# EAGLE design PCB-TLY-JACK-LEDPHOENIX (EAGLE 6.4)
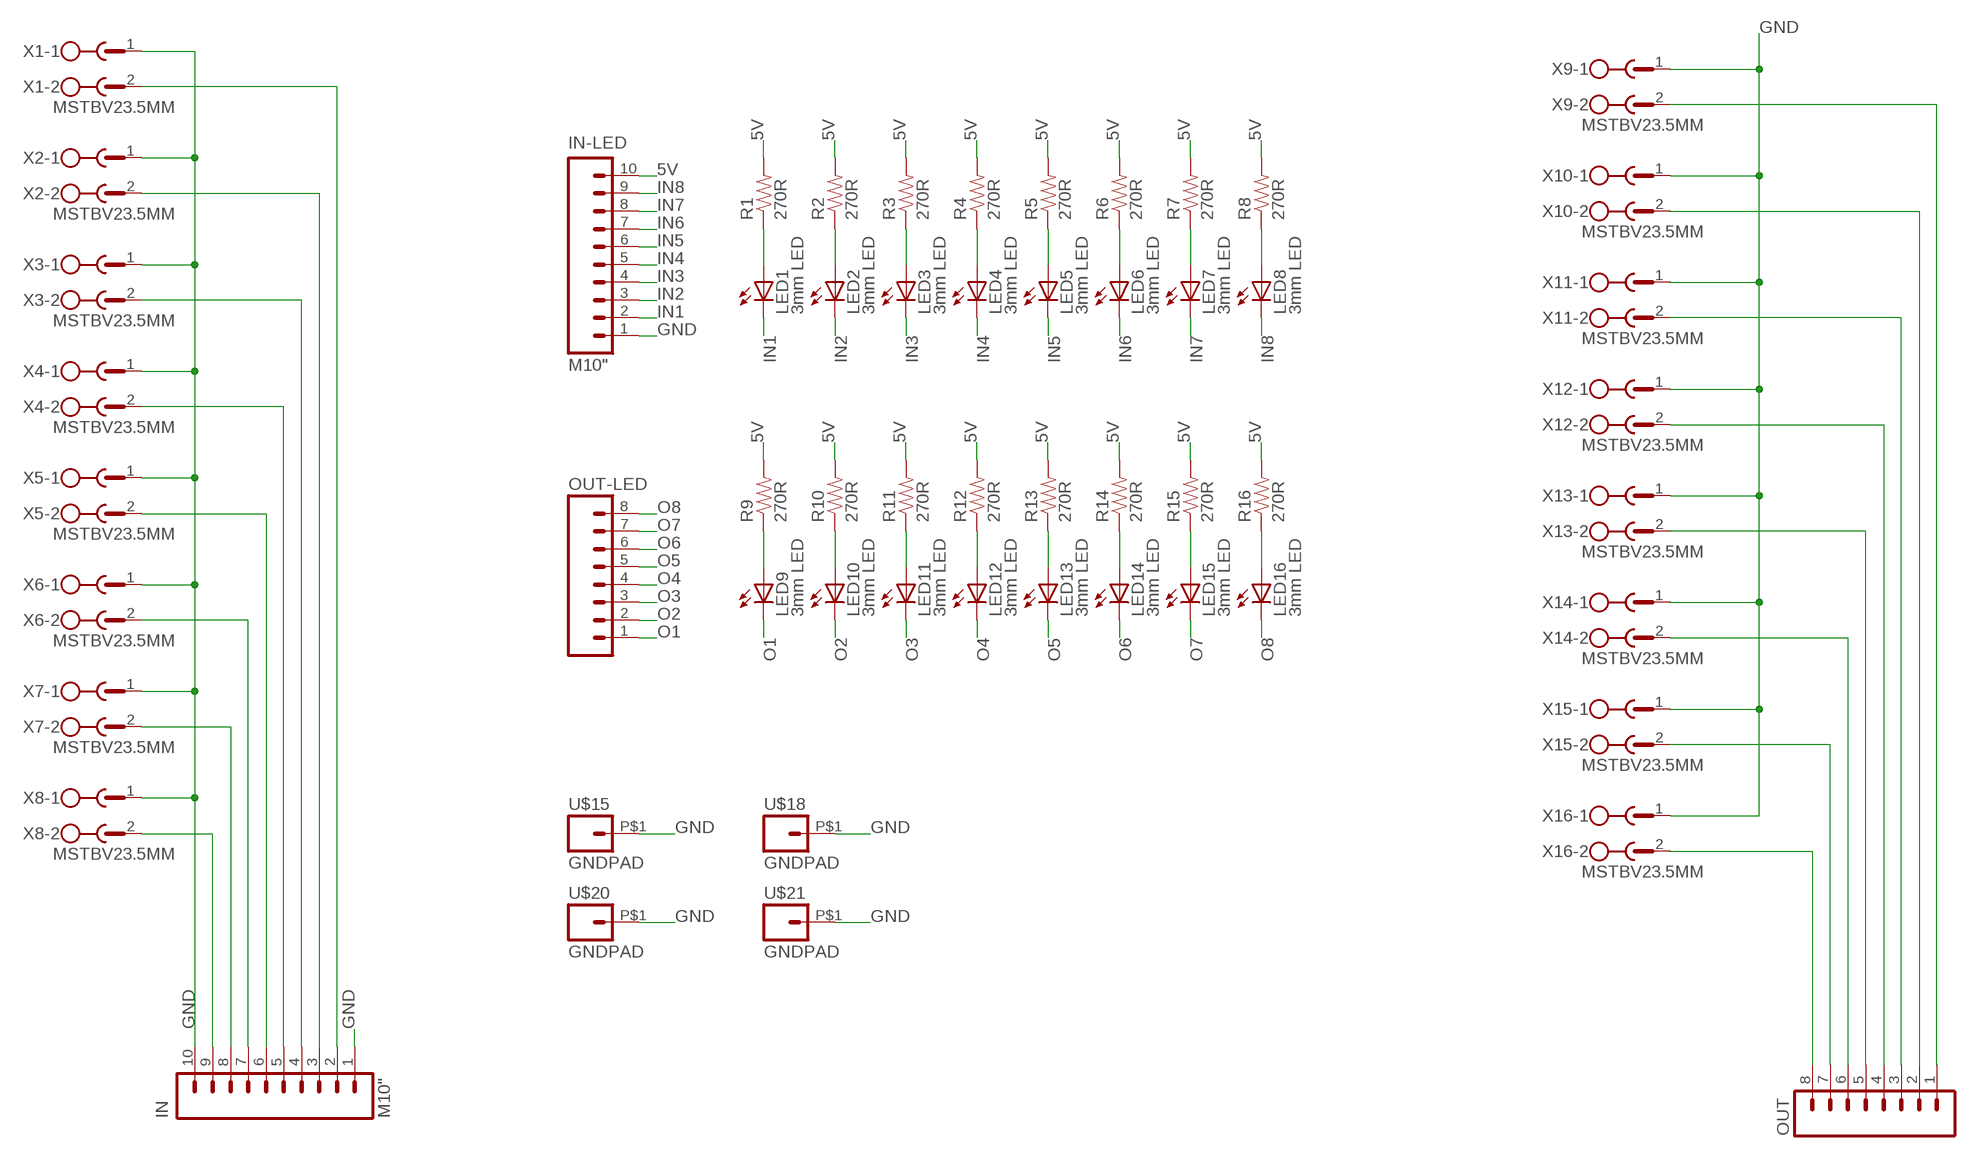
[diagram p0: schematic, sheet 1]

## Parts
IN  M10"  [1X10]
IN-LED  M10"  [1X10]
LED1  3mm LED  LED1206  [LED-1206]
LED2  3mm LED  LED1206  [LED-1206]
LED3  3mm LED  LED1206  [LED-1206]
LED4  3mm LED  LED1206  [LED-1206]
LED5  3mm LED  LED1206  [LED-1206]
LED6  3mm LED  LED1206  [LED-1206]
LED7  3mm LED  LED1206  [LED-1206]
LED8  3mm LED  LED1206  [LED-1206]
LED9  3mm LED  LED1206  [LED-1206]
LED10  3mm LED  LED1206  [LED-1206]
LED11  3mm LED  LED1206  [LED-1206]
LED12  3mm LED  LED1206  [LED-1206]
LED13  3mm LED  LED1206  [LED-1206]
LED14  3mm LED  LED1206  [LED-1206]
LED15  3mm LED  LED1206  [LED-1206]
LED16  3mm LED  LED1206  [LED-1206]
OUT  M081X08  [1X08]
OUT-LED  M081X08  [1X08]
R1  270R  RESISTOR0603-RES  [0603-RES]
R2  270R  RESISTOR0603-RES  [0603-RES]
R3  270R  RESISTOR0603-RES  [0603-RES]
R4  270R  RESISTOR0603-RES  [0603-RES]
R5  270R  RESISTOR0603-RES  [0603-RES]
R6  270R  RESISTOR0603-RES  [0603-RES]
R7  270R  RESISTOR0603-RES  [0603-RES]
R8  270R  RESISTOR0603-RES  [0603-RES]
R9  270R  RESISTOR0603-RES  [0603-RES]
R10  270R  RESISTOR0603-RES  [0603-RES]
R11  270R  RESISTOR0603-RES  [0603-RES]
R12  270R  RESISTOR0603-RES  [0603-RES]
R13  270R  RESISTOR0603-RES  [0603-RES]
R14  270R  RESISTOR0603-RES  [0603-RES]
R15  270R  RESISTOR0603-RES  [0603-RES]
R16  270R  RESISTOR0603-RES  [0603-RES]
U$15  GNDPAD  [3.2MMPAD]
U$18  GNDPAD  [3.2MMPAD]
U$20  GNDPAD  [3.2MMPAD]
U$21  GNDPAD  [3.2MMPAD]
X1  MSTBV23.5MM  [MSTBV2-3.5]
X2  MSTBV23.5MM  [MSTBV2-3.5]
X3  MSTBV23.5MM  [MSTBV2-3.5]
X4  MSTBV23.5MM  [MSTBV2-3.5]
X5  MSTBV23.5MM  [MSTBV2-3.5]
X6  MSTBV23.5MM  [MSTBV2-3.5]
X7  MSTBV23.5MM  [MSTBV2-3.5]
X8  MSTBV23.5MM  [MSTBV2-3.5]
X9  MSTBV23.5MM  [MSTBV2-3.5]
X10  MSTBV23.5MM  [MSTBV2-3.5]
X11  MSTBV23.5MM  [MSTBV2-3.5]
X12  MSTBV23.5MM  [MSTBV2-3.5]
X13  MSTBV23.5MM  [MSTBV2-3.5]
X14  MSTBV23.5MM  [MSTBV2-3.5]
X15  MSTBV23.5MM  [MSTBV2-3.5]
X16  MSTBV23.5MM  [MSTBV2-3.5]

## Nets
5V [Power]: IN-LED.10 R1.2 R2.2 R3.2 R4.2 R5.2 R6.2 R7.2 R8.2 R9.2 R10.2 R11.2 R12.2 R13.2 R14.2 R15.2 R16.2
GND [Power]: IN-LED.1 IN.1 IN.10 U$15.P$1 U$18.P$1 U$20.P$1 U$21.P$1 X1.1 X2.1 X3.1 X4.1 X5.1 X6.1 X7.1 X8.1 X9.1 X10.1 X11.1 X12.1 X13.1 X14.1 X15.1 X16.1
IN1: IN-LED.2 LED1.C
IN2: IN-LED.3 LED2.C
IN3: IN-LED.4 LED3.C
IN4: IN-LED.5 LED4.C
IN5: IN-LED.6 LED5.C
IN6: IN-LED.7 LED6.C
IN7: IN-LED.8 LED7.C
IN8: IN-LED.9 LED8.C
N$1: LED1.A R1.1
N$2: LED2.A R2.1
N$3: LED3.A R3.1
N$4: LED4.A R4.1
N$5: LED5.A R5.1
N$6: LED6.A R6.1
N$7: LED7.A R7.1
N$8: LED8.A R8.1
N$9: LED9.A R9.1
N$10: LED10.A R10.1
N$11: LED11.A R11.1
N$12: LED12.A R12.1
N$13: LED13.A R13.1
N$14: LED14.A R14.1
N$15: LED15.A R15.1
N$16: LED16.A R16.1
N$17 [RELAY LINES]: OUT.2 X10.2
N$18 [RELAY LINES]: OUT.3 X11.2
N$19 [RELAY LINES]: OUT.4 X12.2
N$20 [RELAY LINES]: OUT.5 X13.2
N$21 [RELAY LINES]: OUT.1 X9.2
N$22 [RELAY LINES]: OUT.6 X14.2
N$26 [RELAY LINES]: OUT.7 X15.2
N$30 [RELAY LINES]: OUT.8 X16.2
N$49 [INput lines]: IN.2 X1.2
N$55 [INput lines]: IN.6 X5.2
N$60 [INput lines]: IN.3 X2.2
N$61 [INput lines]: IN.4 X3.2
N$62 [INput lines]: IN.5 X4.2
N$64 [INput lines]: IN.7 X6.2
N$65 [INput lines]: IN.8 X7.2
N$66 [INput lines]: IN.9 X8.2
O1: LED9.C OUT-LED.1
O2: LED10.C OUT-LED.2
O3: LED11.C OUT-LED.3
O4: LED12.C OUT-LED.4
O5: LED13.C OUT-LED.5
O6: LED14.C OUT-LED.6
O7: LED15.C OUT-LED.7
O8: LED16.C OUT-LED.8

## Library data of the parts
IN IN-LED = SparkFun:M10: Header 10 Standard 10-pin 0.1" header. Use with straight break away headers (SKU : PRT-00116), right angle break away headers (PRT-00553), swiss pins (PRT-00743), machine pins (PRT-00117), and female headers (PRT-00115).
LED1-LED16 = SparkFun:LED: LEDs Standard schematic elements and footprints for 5mm, 3mm, 1206, and 0603 sized LEDs. 5mm - Spark Fun Electronics SKU : COM-00529 (and others)
OUT OUT-LED = SparkFun:M08: Header 8 Standard 8-pin 0.1" header. Use with straight break away headers (SKU : PRT-00116), right angle break away headers (PRT-00553), swiss pins (PRT-00743), machine pins (PRT-00117), and female headers (PRT-00115).
R1-R16 = SparkFun:RESISTOR: Resistor Basic schematic elements and footprints for 0603, 1206, and PTH resistors.
U$15 U$18 U$20 U$21 = SKAARHOJ:GNDPAD
X1-X16 = SKAARHOJ:MSTBV2: PHOENIX

## Net classes
0 default: width 0.203 mm, drill 0.406 mm, clearance 0.203 mm
1 Power: width 0.406 mm, drill 0.61 mm, clearance 0.203 mm
2 RELAY LINES: width 0.305 mm, drill 0.406 mm, clearance 0.254 mm
3 INput lines: width 0.203 mm, drill 0.406 mm, clearance 0.254 mm

## Board
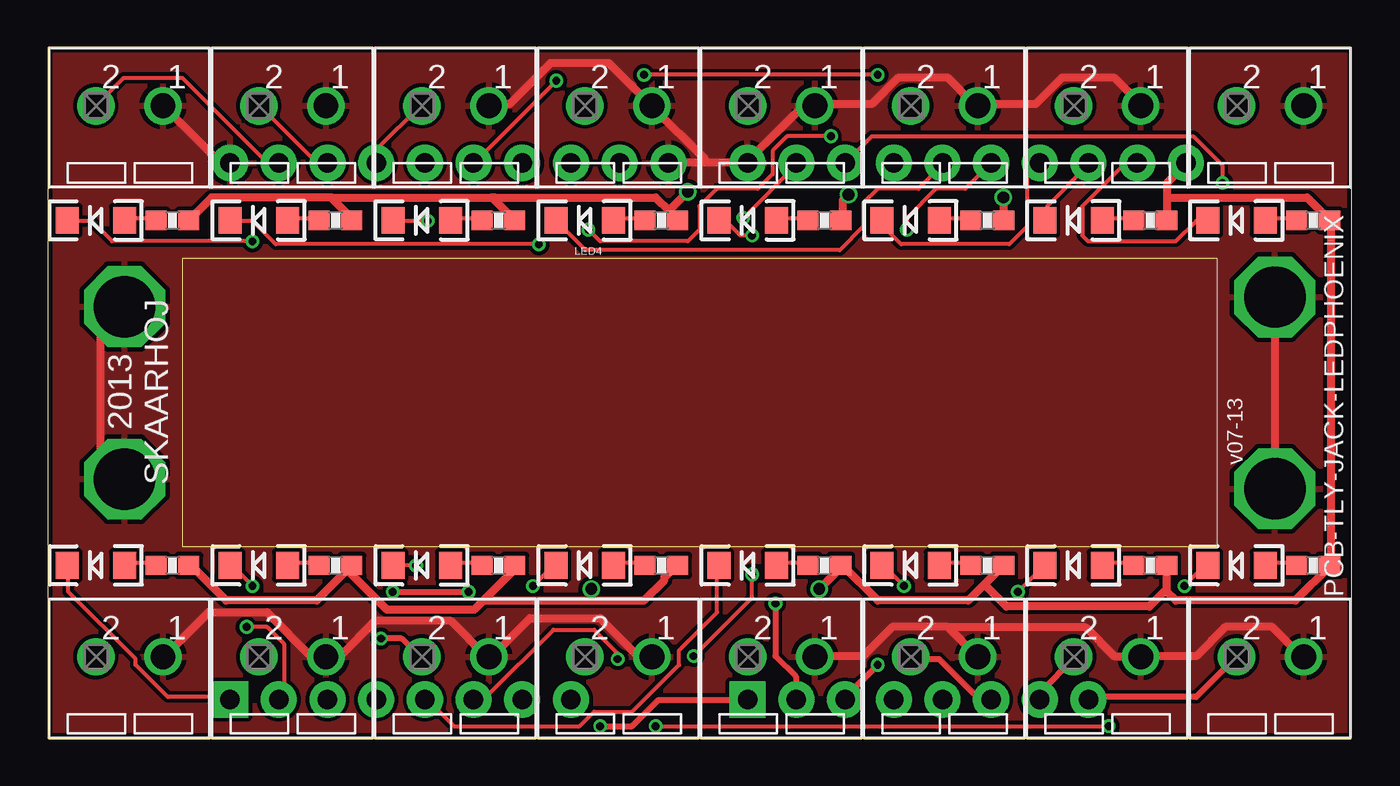
[diagram p1: board, top side]
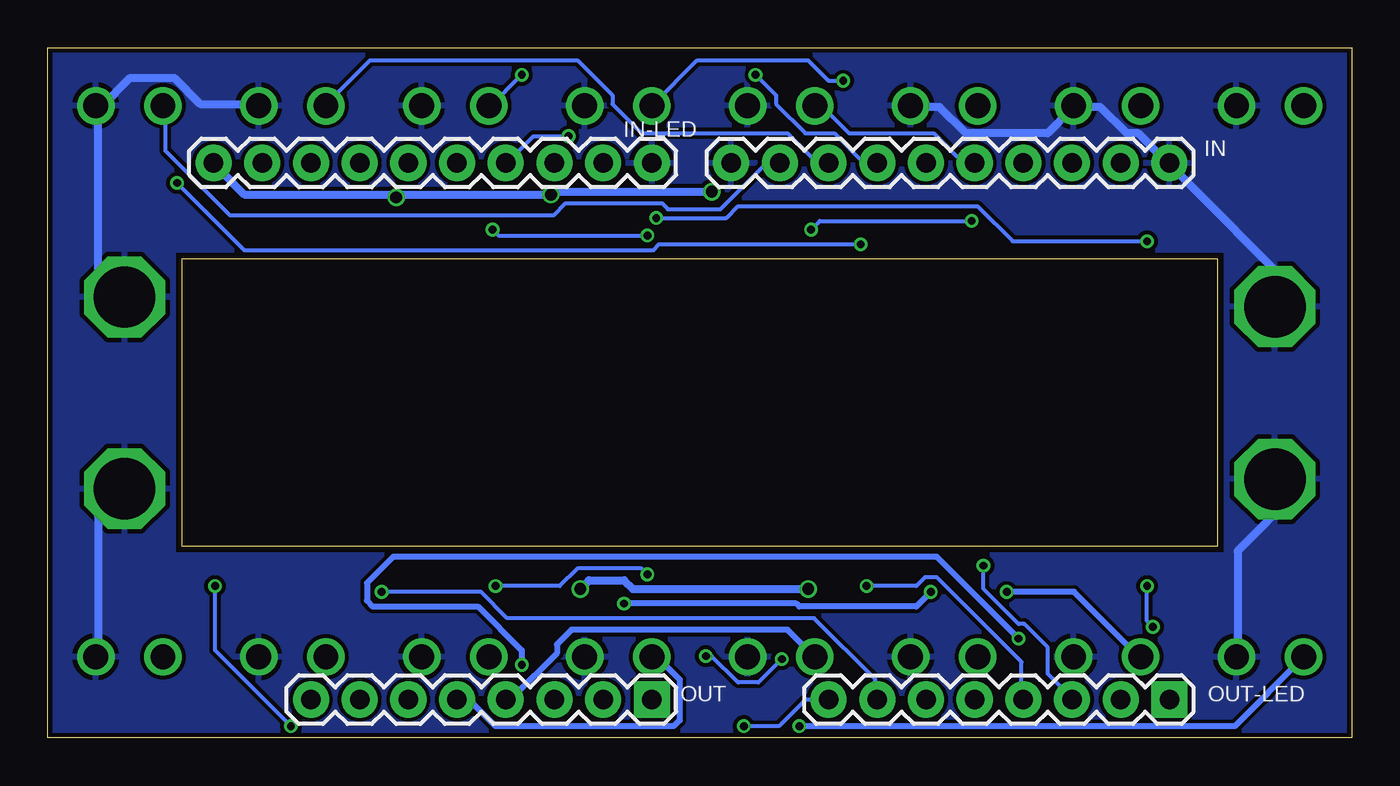
[diagram p2: board, bottom side, seen from below]

Size 68 x 36 mm. Coordinates in mm from the lower left corner, seen from the top.
Outline: 68,0 68,36 0,36 0,0 68,0
Copper layers (1*16): Top 0.035mm / dielectric 1.5mm / Bottom 0.035mm
Design rules "Fusion_eagle_rule_v1.1": minimum track width 6mil, minimum drill 12mil, track to track 6mil, track to pad 6mil, pad to pad 6mil, via to via 6mil, smd to smd 0mil, copper to edge 10mil, drill to drill 10mil, minimum pad ring 10mil, minimum via ring 6mil, stop-mask expansion 2mil, vias tented up to drill 100mil, thermal gap 10mil
bRestrict: area 6.7,9.7 to 61.3,25.3
Milling: area 7,10 to 61,25

### Footprints (pad centres in the part's own frame; a part is rotated, then mirrored left to right if it is on the bottom)
1X10 = drill 1.016 pad 1.88: 1 0,0; 2 2.54,0; 3 5.08,0; 4 7.62,0; 5 10.16,0; 6 12.7,0; 7 15.24,0; 8 17.78,0; 9 20.32,0; 10 22.86,0
LED-1206 = smd 1.2 x 1.4: A -1.5,0; C 1.5,0
1X08 = drill 1.016 pad 1.88 square: 1 0,0 | drill 1.016 pad 1.88: 2 2.54,0; 3 5.08,0; 4 7.62,0; 5 10.16,0; 6 12.7,0; 7 15.24,0; 8 17.78,0
0603-RES = smd 1.1 x 1: 1 -0.85,0; 2 0.85,0
3.2MMPAD = drill 3.2 octagon: P$1 0,0
MSTBV2-3.5 = drill 1.3: 1 -1.75,0.02; 2 1.75,0.02

### Placement (x,y rotation side)
IN  9.5,30 180 bottom
IN-LED  36.5,30 180 bottom
LED1  2.5,27 180 top
LED2  11,27 180 top
LED3  19.5,27 180 top
LED4  28,27 180 top
LED5  36.5,27 180 top
LED6  45,27 180 top
LED7  53.5,27 180 top
LED8  62,27 180 top
LED9  2.5,9 180 top
LED10  11,9 180 top
LED11  19.5,9 180 top
LED12  28,9 180 top
LED13  36.5,9 180 top
LED14  45,9 180 top
LED15  53.5,9 180 top
LED16  62,9 180 top
OUT  36.5,2 180 bottom
OUT-LED  9.5,2 180 bottom
R1  6.5,27 0 top
R2  15,27 0 top
R3  23.5,27 0 top
R4  32,27 0 top
R5  40.5,27 0 top
R6  49,27 0 top
R7  57.5,27 0 top
R8  66,27 0 top
R9  6.5,9 0 top
R10  15,9 0 top
R11  23.5,9 0 top
R12  32,9 0 top
R13  40.5,9 0 top
R14  49,9 0 top
R15  57.5,9 0 top
R16  66,9 0 top
U$15  4,13.5 0 top
U$18  4,22.5 0 top
U$20  64,13 0 top
U$21  64,23 0 top
X1  4.25,33 180 top
X2  12.75,33 180 top
X3  21.25,33 180 top
X4  29.75,33 180 top
X5  38.25,33 180 top
X6  46.75,33 180 top
X7  55.25,33 180 top
X8  63.75,33 180 top
X9  4.25,4.25 180 top
X10  12.75,4.25 180 top
X11  21.25,4.25 180 top
X12  29.75,4.25 180 top
X13  38.25,4.25 180 top
X14  46.75,4.25 180 top
X15  55.25,4.25 180 top
X16  63.75,4.25 180 top

### Tracks (layer width: path | path; a pad name or v marks a point on that pad's centre or on a via)
5V  (via drill 0.61)
  Top 0.406: R9.2 7.47,8.99 9.3,7.16 14.02,7.16 R10.2 15.7,8.69 17.68,6.71 22.25,6.71 22.78,7.24 | 22.78,7.24 24.23,8.69 24.23,8.99 R11.2 | 28.35,7.16 22.86,7.16 22.78,7.24 | 28.35,7.16 31.09,7.16 32.16,8.23 32.16,8.38 32.77,8.99 R12.2 | 48.84,8 49.84,8.99 R14.2 | 48.84,8 48.01,7.16 43.28,7.16 41.45,8.99 R13.2 41.3,8.84 v40.23,7.77 | 58.37,7.62 58.37,8.99 R15.2 | 58.37,7.62 58.83,7.16 65.08,7.16 66.9,8.99 R16.2 66.9,9.14 66.9,26.82 R8.2 66.75,27.13 65.68,28.19 58.37,28.19 | 48.84,8 49.99,6.86 57.45,6.86 58.22,7.62 58.37,7.62 | 14.78,28.19 8.53,28.19 7.47,27.13 R1.2 | 14.78,28.19 15.85,27.13 R2.2 | 23.24,28.12 23.16,28.19 14.78,28.19 | 23.24,28.12 24.23,27.13 R3.2 | 32.38,27.51 31.7,28.19 23.32,28.19 23.24,28.12 | 32.38,27.51 32.77,27.13 R4.2 | v41.76,28.35 41.45,28.04 41.45,27.13 R5.2 | v49.84,28.19 49.84,27.13 R6.2 | 58.37,28.19 58.37,28.96 59.28,29.87 IN-LED.10 | 58.37,28.19 58.37,27.13 R7.2 | v33.38,28.5 32.38,27.51 | v28.35,7.77 28.35,7.16
  Bottom 0.406: 49.84,28.35 57.76,28.35 59.28,29.87 IN-LED.10 | 49.84,28.35 v41.76,28.35 41.76,28.5 v33.38,28.5 | v49.84,28.19 49.84,28.35 | v28.35,7.77 37.49,7.77 37.95,8.23 39.78,8.23 v40.23,7.77
GND
  Top 0.406: IN.1 9.45,30.02 8.99,30.02 6.1,32.92 X1.1 | X12.1 31.39,4.27 30.79,4.27 28.8,6.25 25.15,6.25 23.16,4.27 X11.1 22.86,4.27 21.03,6.1 17.07,6.1 15.24,4.27 14.63,4.27 X10.1 14.33,4.27 13.72,4.27 11.43,6.55 8.38,6.55 6.1,4.27 X9.1 | U$18.P$1 2.74,22.86 2.74,13.11 U$15.P$1 | 46.94,5.79 44.04,5.79 42.52,4.27 40.08,4.27 X13.1 | 46.94,5.79 48.46,4.27 X14.1 | 46.94,5.79 54.1,5.79 55.63,4.27 57,4.27 X15.1 57.15,4.27 59.89,4.27 61.42,5.79 63.86,5.79 65.38,4.27 X16.1 | 34.29,30.02 36.42,30.02 IN-LED.1 36.58,30.18 39.32,32.92 39.93,32.92 X5.1 40.08,33.07 42.98,33.07 44.35,34.44 46.94,34.44 48.31,33.07 X6.1 48.62,33.07 51.51,33.07 52.88,34.44 55.63,34.44 57,33.07 X7.1 | 34.29,30.02 32.46,30.02 IN.10 | 34.29,30.02 34.29,30.18 31.55,32.92 X4.1 31.39,33.07 29.26,35.2 26.21,35.2 24.08,33.07 23.01,33.07 X3.1 | U$20.P$1 64.01,13.11 64.01,22.86 U$21.P$1
  Bottom 0.406: X3.1 22.86,32.92 21.49,32.92 20.12,31.55 15.85,31.55 14.63,32.77 X2.1 14.48,32.92 13.11,32.92 11.73,31.55 11.12,31.55 9.6,30.02 IN.1 9.45,29.87 2.59,23.01 U$18.P$1 | X9.1 5.94,4.27 5.94,9.75 2.74,12.95 U$15.P$1 | X16.1 65.38,4.27 65.38,11.58 64.01,12.95 U$20.P$1 | U$21.P$1 64.01,23.01 65.38,24.38 65.38,32.92 X8.1 65.23,32.92 63.7,34.44 61.42,34.44 60.05,33.07 57.15,33.07 X7.1
  pour Top: 0,0 68,0 68,36 0,36
  pour Bottom: 0,0 68,0 68,36 0,36
IN1  (via drill 0.41)
  Top 0.203: v10.67,25.91 3.35,25.91 2.29,26.98 1.07,26.98 LED1.C | v36.27,27.13 39.01,29.87 IN-LED.2
  Bottom 0.203: v10.67,25.91 17.68,25.91 19.51,27.74 32,27.74 32.61,27.13 v36.27,27.13
IN2  (via drill 0.41)
  Top 0.203: v25.6,25.76 11.89,25.76 10.67,26.98 9.6,26.98 LED2.C | v61.27,28.96 61.27,29.87 59.74,31.39 42.98,31.39 41.6,30.02 IN-LED.3
  Bottom 0.203: v25.6,25.76 36.12,25.76 36.42,25.45 57.76,25.45 v61.27,28.96
IN3  (via drill 0.41)
  Top 0.203: v19.81,26.98 18.14,26.98 LED3.C | v28.19,26.52 28.8,25.91 33.38,25.91 33.98,26.52 33.98,27.74 34.9,28.65 37.03,28.65 37.8,29.41 37.8,30.63 38.56,31.39 v40.84,31.39
  Bottom 0.203: v19.81,26.98 27.74,26.98 v28.19,26.52 | v40.84,31.39 42.67,31.39 44.04,30.02 IN-LED.4
IN4
  Top 0.203: LED4.C 26.52,26.98 28.04,25.45 41.3,25.45 42.52,26.67 42.52,27.89 43.28,28.65 45.41,28.65 46.63,29.87 IN-LED.5
IN5  (via drill 0.41)
  Top 0.203: v36.73,26.21 36.12,26.21 35.36,26.98 35.05,26.98 LED5.C | v44.81,26.52 44.81,27.13 46.33,28.65 47.85,28.65 49.07,29.87 IN-LED.6
  Bottom 0.203: v36.73,26.21 44.5,26.21 v44.81,26.52
IN6
  Top 0.203: LED6.C 43.59,26.98 43.59,26.67 44.5,25.76 50.14,25.76 51.05,26.67 51.05,29.26 51.66,29.87 IN-LED.7
IN7
  Top 0.203: LED7.C 52.12,27.13 52.12,27.74 54.25,29.87 IN-LED.8
IN8
  Top 0.203: LED8.C 60.35,26.98 59.89,26.98 58.83,25.91 54.25,25.91 53.95,26.21 53.95,27.74 56.08,29.87 56.69,29.87 IN-LED.9
N$1
  Top 0.203: R1.1 5.64,27.13 4.12,27.13 LED1.A
N$2
  Top 0.203: R2.1 14.02,27.13 12.65,27.13 LED2.A
N$3
  Top 0.203: R3.1 22.55,27.13 21.03,27.13 LED3.A
N$4
  Top 0.203: R4.1 31.09,27.13 29.57,27.13 LED4.A
N$5
  Top 0.203: R5.1 39.62,27.13 38.1,27.13 LED5.A
N$6
  Top 0.203: R6.1 48.01,27.13 46.63,27.13 LED6.A
N$7
  Top 0.203: R7.1 56.54,27.13 55.02,27.13 LED7.A
N$8
  Top 0.203: R8.1 65.08,27.13 63.55,27.13 LED8.A
N$9
  Top 0.203: R9.1 5.64,9.14 4.12,9.14 LED9.A
N$10
  Top 0.203: R10.1 14.02,9.14 12.65,9.14 LED10.A
N$11
  Top 0.203: R11.1 22.55,9.14 21.03,9.14 LED11.A
N$12
  Top 0.203: R12.1 31.09,9.14 29.57,9.14 LED12.A
N$13
  Top 0.203: R13.1 39.62,9.14 38.1,9.14 LED13.A
N$14
  Top 0.203: R14.1 48.01,9.14 46.63,9.14 LED14.A
N$15
  Top 0.203: R15.1 56.54,9.14 55.02,9.14 LED15.A
N$16
  Top 0.203: R16.1 65.08,9.14 63.55,9.14 LED16.A
N$17  (via drill 0.41)
  Top 0.305: v37.95,7.01 37.95,4.27 39.01,3.2 39.01,2.13 OUT.2 | v17.98,7.62 v21.95,7.62
  Bottom 0.305: v37.95,7.01 28.96,7.01 28.8,6.86 22.71,6.86 v21.95,7.62 | v17.98,7.62 14.48,7.62 11.12,4.27 X10.2
N$18  (via drill 0.41)
  Top 0.305: v43.28,3.81 41.6,2.13 OUT.3 | v17.37,5.18 18.44,5.18 19.36,4.27 X11.2
  Bottom 0.305: v43.28,3.81 43.28,4.57 45.57,6.86 51.05,6.86 51.36,7.16 51.36,8.08 49.99,9.45 21.64,9.45 v17.37,5.18
N$19
  Bottom 0.305: OUT.4 44.04,2.13 43.74,2.13 41.45,4.42 41.45,4.88 40.69,5.64 29.41,5.64 28.04,4.27 X12.2
N$20
  Bottom 0.305: OUT.5 46.63,1.98 46.02,1.98 44.65,0.61 35.36,0.61 35.05,0.91 35.05,3.05 36.12,4.12 36.42,4.12 X13.2
N$21  (via drill 0.41)
  Top 0.305: v28.8,0.61 30.48,0.61 31.85,1.98 36.42,1.98 OUT.1
  Bottom 0.305: v28.8,0.61 6.1,0.61 2.59,4.12 X9.2
N$22
  Top 0.305: OUT.6 49.07,2.13 48.46,2.13 46.48,4.12 45.11,4.12 X14.2
N$26
  Top 0.305: OUT.7 51.82,2.13 51.82,2.44 53.49,4.12 X15.2
N$30
  Top 0.305: OUT.8 54.41,2.13 59.89,2.13 61.87,4.12 X16.2
N$49
  Top 0.203: X1.2 3.96,34.44 7.01,34.44 11.43,30.02 12.04,30.02 IN.2
N$55  (via drill 0.41)
  Top 0.203: v26.52,34.29 22.25,30.02 IN.6
  Bottom 0.203: v26.52,34.29 27.28,34.29 28.35,35.36 34.14,35.36 36.42,33.07 X5.2
N$60
  Top 0.203: IN.3 14.48,30.02 14.02,30.02 11.12,32.92 X2.2
N$61
  Top 0.203: IN.4 17.22,30.02 17.22,30.79 19.36,32.92 X3.2
N$62
  Bottom 0.203: IN.5 19.81,30.02 20.27,30.02 21.79,31.55 26.21,31.55 27.58,32.92 27.89,32.92 X4.2
N$64  (via drill 0.41)
  Top 0.203: v43.28,34.59 v31.09,34.59
  Bottom 0.203: v31.09,34.59 30.02,33.53 30.02,33.07 28.5,31.55 26.98,31.55 25.45,30.02 24.84,30.02 IN.7 | v43.28,34.59 44.96,32.92 X6.2
N$65
  Bottom 0.203: IN.8 27.43,30.02 27.89,30.02 29.41,31.55 37.03,31.55 38.56,33.07 38.56,33.53 40.39,35.36 51.21,35.36 53.49,33.07 X7.2
N$66
  Bottom 0.203: IN.9 29.87,29.87 30.63,29.87 32.92,27.58 35.66,27.58 35.97,27.89 41,27.89 41.6,27.28 58.52,27.28 61.87,30.63 61.87,32.92 X8.2
O1
  Top 0.203: LED9.C 1.07,8.99 1.07,7.62 4.57,4.12 4.57,3.81 6.25,2.13 9.45,2.13 OUT-LED.1
O2  (via drill 0.41)
  Top 0.203: v10.67,7.92 9.6,8.99 LED10.C | v10.36,5.79 11.43,5.79 12.34,4.88 12.34,2.29 12.19,2.13 OUT-LED.2
  Bottom 0.203: v10.67,7.92 10.67,6.1 v10.36,5.79
O3  (via drill 0.41)
  Top 0.203: v19.2,8.99 18.14,8.99 LED11.C
  Bottom 0.203: v19.2,8.99 19.2,7.77 17.37,5.94 17.07,5.94 15.85,4.72 15.85,3.35 14.63,2.13 OUT-LED.3
O4  (via drill 0.41)
  Top 0.203: v25.3,7.92 26.36,8.99 LED12.C
  Bottom 0.203: v25.3,7.92 22.71,7.92 22.25,8.38 21.64,8.38 17.22,3.96 17.22,2.13 OUT-LED.4
O5
  Top 0.203: LED13.C 34.9,8.99 34.9,6.55 32.92,4.57 32.92,3.81 30.48,1.37 28.5,1.37 27.74,0.61 21.18,0.61 19.81,1.98 OUT-LED.5
O6  (via drill 0.41)
  Top 0.203: v44.65,7.92 43.59,8.99 LED14.C | v36.73,8.53 36.73,7.32 v33.68,4.27 | v29.72,4.12 29.72,4.42 28.5,5.64 26.36,5.64 22.86,2.13 22.25,2.13 OUT-LED.6
  Bottom 0.203: v44.65,7.92 41.3,7.92 40.39,8.84 37.03,8.84 v36.73,8.53 | v33.68,4.27 33.38,4.27 32,2.9 30.94,2.9 v29.72,4.12
O7  (via drill 0.41)
  Top 0.203: v50.6,7.62 51.97,8.99 LED15.C
  Bottom 0.203: v50.6,7.62 45.41,7.62 44.04,6.25 28.04,6.25 24.84,3.05 24.84,2.13 OUT-LED.7
O8  (via drill 0.41)
  Top 0.203: v59.28,7.92 60.35,8.99 LED16.C | v31.7,0.61 v55.32,0.61
  Bottom 0.203: v59.28,7.92 59.28,4.57 v55.32,0.61 | v31.7,0.61 29.87,0.61 28.5,1.98 27.43,1.98 OUT-LED.8

### Text on the board
_tsilk: 2013 / SKAARHOJ | v07-13 | PCB-TLY-JACK-LEDPHOENIX